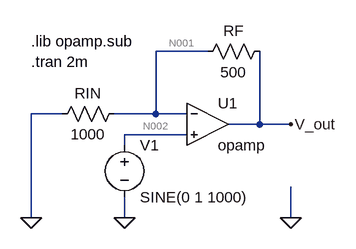
[diagram p0: schematic invert_prelab.asc]
invert_prelab.asc, the LTspice schematic file:
Version 4
SHEET 1 880 680
WIRE 384 -48 304 -48
WIRE 160 48 112 48
WIRE 304 48 304 -48
WIRE 304 48 240 48
WIRE 352 48 304 48
WIRE 464 64 464 -48
WIRE 464 64 416 64
WIRE 512 64 464 64
WIRE 352 80 256 80
WIRE 256 96 256 80
WIRE 112 208 112 48
WIRE 256 208 256 176
WIRE 512 208 512 160
FLAG 112 208 0
FLAG 256 208 0
FLAG 512 208 0
FLAG 512 64 V_out
SYMBOL res 256 32 R90
WINDOW 0 0 56 VBottom 2
WINDOW 3 32 56 VTop 2
SYMATTR InstName RIN
SYMATTR Value 1000
SYMBOL res 480 -64 R90
WINDOW 0 0 56 VBottom 2
WINDOW 3 32 56 VTop 2
SYMATTR InstName RF
SYMATTR Value 500
SYMBOL Opamps\\opamp 384 0 R0
SYMATTR InstName U1
SYMBOL voltage 256 80 R0
WINDOW 123 0 0 Left 0
WINDOW 39 0 0 Left 0
SYMATTR InstName V1
SYMATTR Value SINE(0 1 1000)
TEXT 112 -64 Left 2 !.lib opamp.sub
TEXT 112 -32 Left 2 !.tran 2m

The netlist it stands for:
* invert_prelab.asc
RIN N001 0 1000
RF V_out N001 500
XU1 N001 N002 V_out opamp Aol=100K GBW=10Meg  ; pins invin noninvin out
V1 N002 0 SINE(0 1 1000)
.lib opamp.sub
.tran 2m
.backanno
.end

* Results of the author's LTspice run, read from the files saved beside the schematic
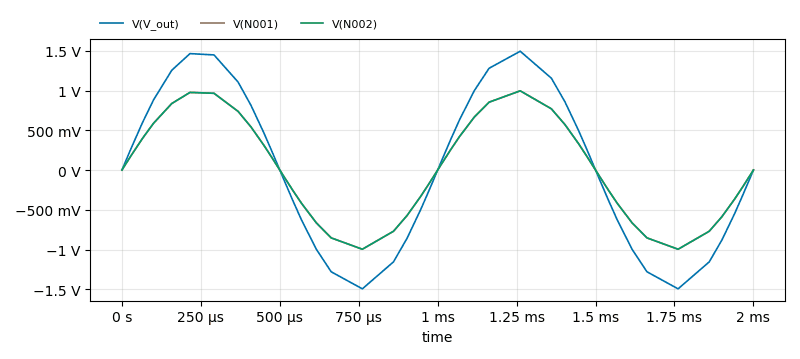
[diagram p1: Transient Analysis of invert_prelab.asc, plotted from the saved traces]
* Transient Analysis, 1 run:
*   V(V_out): min -1.495 V, max 1.495 V, average 1.972 mV, rms 1.044 V, last -225 µV
*   V(N001): min -996.5 mV, max 996.5 mV, average 1.315 mV, rms 695.8 mV, last -150 µV
*   V(N002): min -996.6 mV, max 996.6 mV, average 1.315 mV, rms 695.8 mV, last 0 V